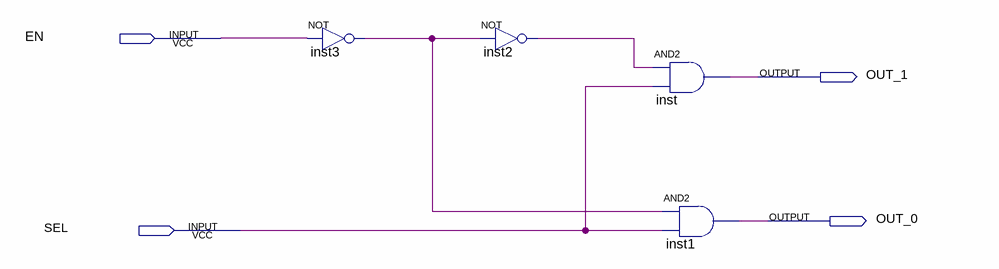
[diagram p0: schematic sheet]
// Quartus schematic Decoder1to2.bdf as structural Verilog: 4 symbols, 4 pins
module Decoder1to2 (
  input  EN,
  input  SEL,
  output OUT_1,
  output OUT_0
);

  wire inst2_out, inst3_out;

  not inst3 (inst3_out, EN);
  not inst2 (inst2_out, inst3_out);
  and inst (OUT_1, inst2_out, SEL);
  and inst1 (OUT_0, inst3_out, SEL);
endmodule
